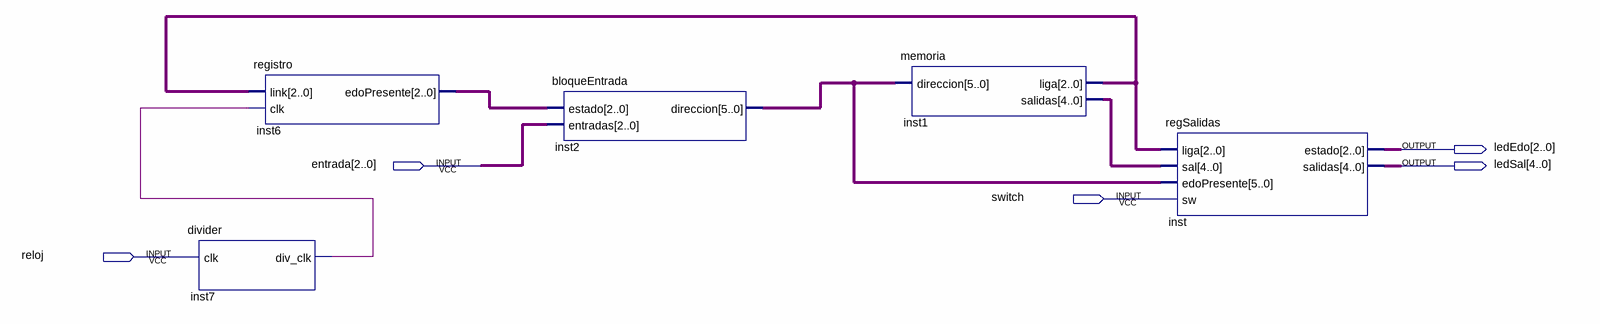
[diagram p0: schematic sheet]
// Quartus schematic practica3.bdf as structural Verilog: 5 symbols, 5 pins
module practica3 (
  input  [2:0] entrada,
  input  switch,
  input  reloj,
  output [2:0] ledEdo,
  output [4:0] ledSal
);

  wire inst7_div_clk;
  wire [2:0] inst1_liga, inst6_edopresente;
  wire [4:0] inst1_salidas;
  wire [5:0] inst2_direccion;

  divider inst7 (.clk(reloj), .div_clk(inst7_div_clk));
  registro inst6 (.link(inst1_liga), .clk(inst7_div_clk), .edoPresente(inst6_edopresente));
  bloqueEntrada inst2 (.estado(inst6_edopresente), .entradas(entrada), .direccion(inst2_direccion));
  memoria inst1 (.direccion(inst2_direccion), .liga(inst1_liga), .salidas(inst1_salidas));
  regSalidas inst (
    .liga(inst1_liga), .sal(inst1_salidas), .edoPresente(inst2_direccion), .sw(switch), .estado(ledEdo),
    .salidas(ledSal));
endmodule
